# EasyEDA Pro project Project_FT-LINK_2024-04-09.epro

# Schematic FT-LINK-v1
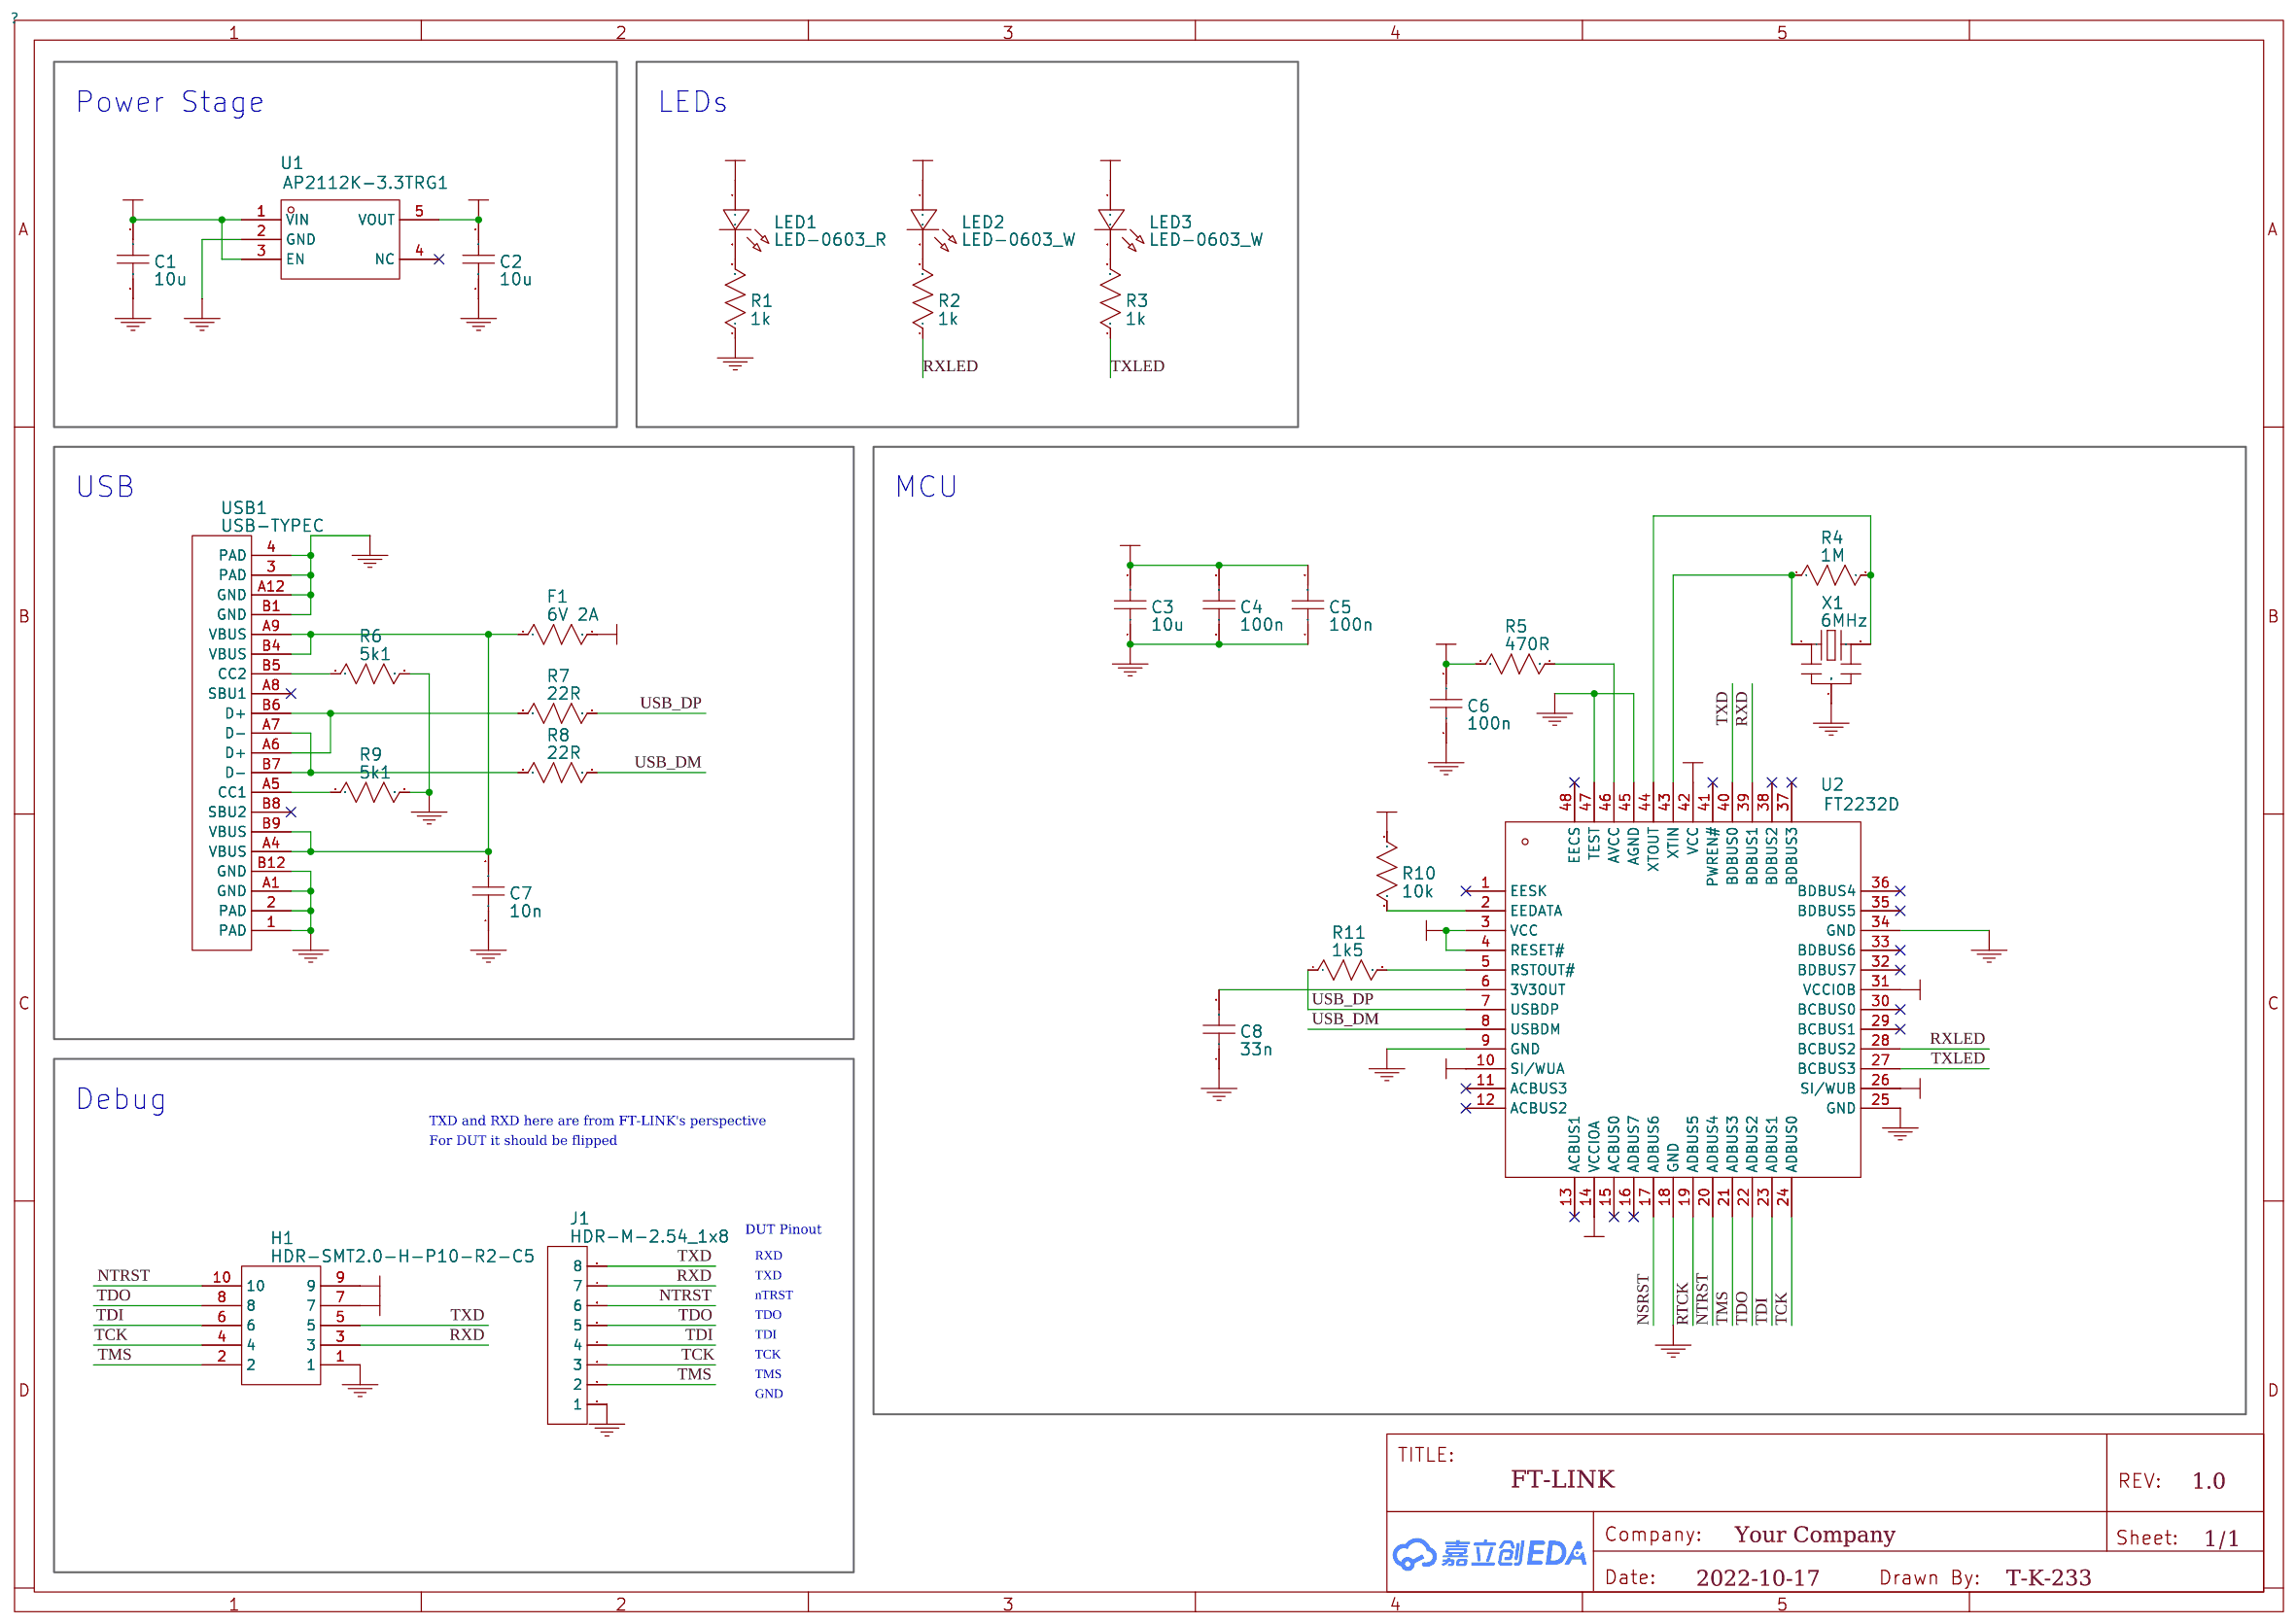
[diagram p0: schematic sheet]

## Parts
C1  10u  [CAPA-0603]
C2  10u  [CAPA-0603]
C3  10u  [CAPA-0603]
C4  100n  [CAPA-0402]
C5  100n  [CAPA-0402]
C6  100n  [CAPA-0402]
C7  10n  [CAPA-0402]
C8  33n  [CAPA-0603]
F1  6V 2A  [R0805]
H1  HDR-SMT2.0-H-P10-R2-C5  [HDR-SMT2.0-H-P10-R2-C5]  (no BOM)
J1  HDR-M-2.54_1x8  [HDR-M-2.54_1X8]
LED1  LED-0603_R  [LED-0603]
LED2  LED-0603_W  [LED-0603]
LED3  LED-0603_W  [LED-0603]
R1  1k  [RES-0402]
R2  1k  [RES-0402]
R3  1k  [RES-0402]
R4  1M  [RES-0402]
R5  470R  [RES-0402]
R6  5k1  [RES-0402]
R7  22R  [RES-0402]
R8  22R  [RES-0402]
R9  5k1  [RES-0402]
R10  10k  [RES-0402]
R11  1k5  [RES-0402]
U1  AP2112K-3.3TRG1  [SOT-25-5_L3.0-W1.8-P0.95-LS3.0-BR]
U2  FT2232D  [LQFP-48_L7.0-W7.0-P0.50-LS9.0-BL]
USB1  USB-TYPEC  [USB-C-SMD_KH-TYPE-C-16P]
X1  6MHz  [CRYSTAL-SMD_3P-L4.5-W2.0-L]

## Library data of the parts
C1-C3 = CL10A106KP8NNNC: Supplier Part: C19702; Supplier: LCSC; Manufacturer: SAMSUNG; link: https://atta.szlcsc.com/upload/public/pdf/source/20160103/1457707703378.pdf
C4-C6 = CL05B104KB54PNC: Supplier Part: C307331; Supplier: LCSC; Manufacturer: SAMSUNG; link: https://atta.szlcsc.com//upload/public/pdf/source/20160103/1457707735223.pdf
C7 = CL05B103KB5NNNC: Supplier Part: C15195; Supplier: LCSC; Manufacturer: SAMSUNG; link: https://atta.szlcsc.com//upload/public/pdf/source/20160103/1457707735223.pdf
C8 = CL10B333KB8NNNC: Supplier Part: C21117; Supplier: LCSC; Manufacturer: SAMSUNG; link: https://atta.szlcsc.com//upload/public/pdf/source/20160103/1457707679526.pdf
F1 = SL0805200: Supplier Part: C70158; Supplier: LCSC; Manufacturer: TECHFUSE
H1 = HDR-SMT2.0-H-P10-R2-C5
J1 = HDR-M-2.54_1x8: Supplier Part: C190820; Supplier: LCSC
LED1 = 19-217/R6C-AL1M2VY/3T: Manufacturer: EVERLIGHT 台湾亿光; Supplier Part: C72044; Supplier: LCSC; link: https://atta.szlcsc.com//upload/public/pdf/source/20160507/1462613613821.pdf
LED2 LED3 = LED White: Manufacturer: KENTO; Supplier Part: C2290; Supplier: LCSC; link: https://atta.szlcsc.com//upload/public/pdf/source/20160507/1462613613821.pdf
R1-R3 = 0402WGF1001TCE: Supplier Part: C11702; Supplier: LCSC; Manufacturer: UniOhm 台湾厚声; link: https://atta.szlcsc.com//upload/public/pdf/source/20200306/C422600_1E6D84923E4A46A82E41ADD87F860B5C.pdf
R4 = 0402WGF1004TCE: Supplier Part: C26083; Supplier: LCSC; Manufacturer: UniOhm 台湾厚声; link: https://atta.szlcsc.com//upload/public/pdf/source/20200306/C422600_1E6D84923E4A46A82E41ADD87F860B5C.pdf
R5 = 0402WGF4700TCE: Supplier Part: C25117; Supplier: LCSC; Manufacturer: UniOhm 台湾厚声; link: https://atta.szlcsc.com//upload/public/pdf/source/20200306/C422600_1E6D84923E4A46A82E41ADD87F860B5C.pdf
R6 R9 = 0402WGF5101TCE: Supplier Part: C25905; Supplier: LCSC; Manufacturer: UniOhm 台湾厚声; link: https://atta.szlcsc.com//upload/public/pdf/source/20200306/C422600_1E6D84923E4A46A82E41ADD87F860B5C.pdf
R7 R8 = 0402WGF220JTCE: Supplier Part: C25092; Supplier: LCSC; Manufacturer: UniOhm 台湾厚声; link: https://atta.szlcsc.com//upload/public/pdf/source/20200306/C422600_1E6D84923E4A46A82E41ADD87F860B5C.pdf
R10 = 0402WGF1002TCE: Supplier Part: C25744; Supplier: LCSC; Manufacturer: UniOhm 台湾厚声; link: https://atta.szlcsc.com//upload/public/pdf/source/20200306/C422600_1E6D84923E4A46A82E41ADD87F860B5C.pdf
R11 = 0402WGF1501TCE: Supplier Part: C25867; Supplier: LCSC; Manufacturer: UniOhm 台湾厚声
U1 = AP2112K-3.3TRG1: Supplier: LCSC; Manufacturer: DIODES; Supplier Part: C51118; JLCPCB Part Class: Extended Part; link: https://www.diodes.com/assets/Datasheets/AP2112.pdf
U2 = FT2232D: Supplier: LCSC; Supplier Part: C428116; Manufacturer: FTDI; JLCPCB Part Class: Extended Part; link: http://www.ftdichip.com/Support/Documents/DataSheets/ICs/DS_FT2232D.pdf
USB1 = KH-TYPE-C-16P: Manufacturer: Shenzhen Kinghelm Elec; Supplier: LCSC; Supplier Part: C709357; link: https://atta.szlcsc.com/upload/public/pdf/source/20211022/DACD6552F639E9483017DE6DC0E61150.pdf
X1 = CSTCR6M00G53-R0: Supplier: LCSC; Manufacturer: muRata(村田); Supplier Part: C85845; JLCPCB Part Class: Extended Part

## Nets
3V3: C2.2 C3.2 C4.2 C5.2 H1.7 LED1.1 LED2.1 LED3.1 U1.5(VOUT) U2.10(SI/WUA) U2.14(VCCIOA) U2.26(SI/WUB) U2.31(VCCIOB)
5V: C1.2 C6.2 F1.2 H1.9 R5.1 R10.1 U1.1(VIN) U1.3(EN) U2.3(VCC) U2.4(RESET#) U2.42(VCC)
GND: C1.1 C2.1 C3.1 C4.1 C5.1 C6.1 C7.1 C8.1 H1.1 J1.1 R1.1 R6.2 R9.2 U1.2(GND) U2.9(GND) U2.18(GND) U2.25(GND) U2.34(GND) U2.45(AGND) U2.47(TEST) USB1.1(PAD) USB1.2(PAD) USB1.3(PAD) USB1.4(PAD) USB1.A1(GND) USB1.A12(GND) USB1.B1(GND) USB1.B12(GND) X1.2(GND)
NSRST: U2.17(ADBUS6)
NTRST: H1.10 J1.6 U2.20(ADBUS4)
RTCK: U2.19(ADBUS5)
RXD: H1.3 J1.7 U2.39(BDBUS1)
RXLED: R2.1 U2.28(BCBUS2)
TCK: H1.4 J1.3 U2.24(ADBUS0)
TDI: H1.6 J1.4 U2.23(ADBUS1)
TDO: H1.8 J1.5 U2.22(ADBUS2)
TMS: H1.2 J1.2 U2.21(ADBUS3)
TXD: H1.5 J1.8 U2.40(BDBUS0)
TXLED: R3.1 U2.27(BCBUS3)
USB_DM: R8.2 U2.8(USBDM)
USB_DP: R7.2 R11.1 U2.7(USBDP)
C8_2: C8.2 U2.6(3V3OUT)
F1_1: C7.2 F1.1 USB1.A4(VBUS) USB1.A9(VBUS) USB1.B4(VBUS) USB1.B9(VBUS)
LED1_2: LED1.2 R1.2
LED2_2: LED2.2 R2.2
LED3_2: LED3.2 R3.2
R4_1: R4.1 U2.43(XTIN) X1.1(IN)
R4_2: R4.2 U2.44(XTOUT) X1.3(OUT)
R5_2: R5.2 U2.46(AVCC)
R6_1: R6.1 USB1.B5(CC2)
R9_1: R9.1 USB1.A5(CC1)
R10_2: R10.2 U2.2(EEDATA)
R11_2: R11.2 U2.5(RSTOUT#)
USB1_A6: R7.1 USB1.A6(D+) USB1.B6(D+)
USB1_B7: R8.1 USB1.A7(D-) USB1.B7(D-)

Not connected (* = marked no-connect by the designer): U1 4(NC)*; U2 1(EESK)* 11(ACBUS3)* 12(ACBUS2)* 13(ACBUS1)* 15(ACBUS0)* 16(ADBUS7)* 29(BCBUS1)* 30(BCBUS0)* 32(BDBUS7)* 33(BDBUS6)* 35(BDBUS5)* 36(BDBUS4)* 37(BDBUS3)* 38(BDBUS2)* 41(PWREN#)* 48(EECS)*; USB1 A8(SBU1)* B8(SBU2)*

## Notes on the sheet
- Power Stage
- LEDs
- USB
- MCU
- Debug
- For DUT it should be flipped
- TXD and RXD here are from FT-LINK's perspective
- DUT Pinout
- RXD
- TXD
- nTRST
- TDO
- TDI
- TCK
- TMS
- GND

# Schematic FT-LINK-v2
Create Date: 2024-02-24; Project Name: FT-LINK; Schematic Name: FT-LINK-v2; Update Date: 2024-02-29; Company: UC Berkeley; Version: V2.0.0
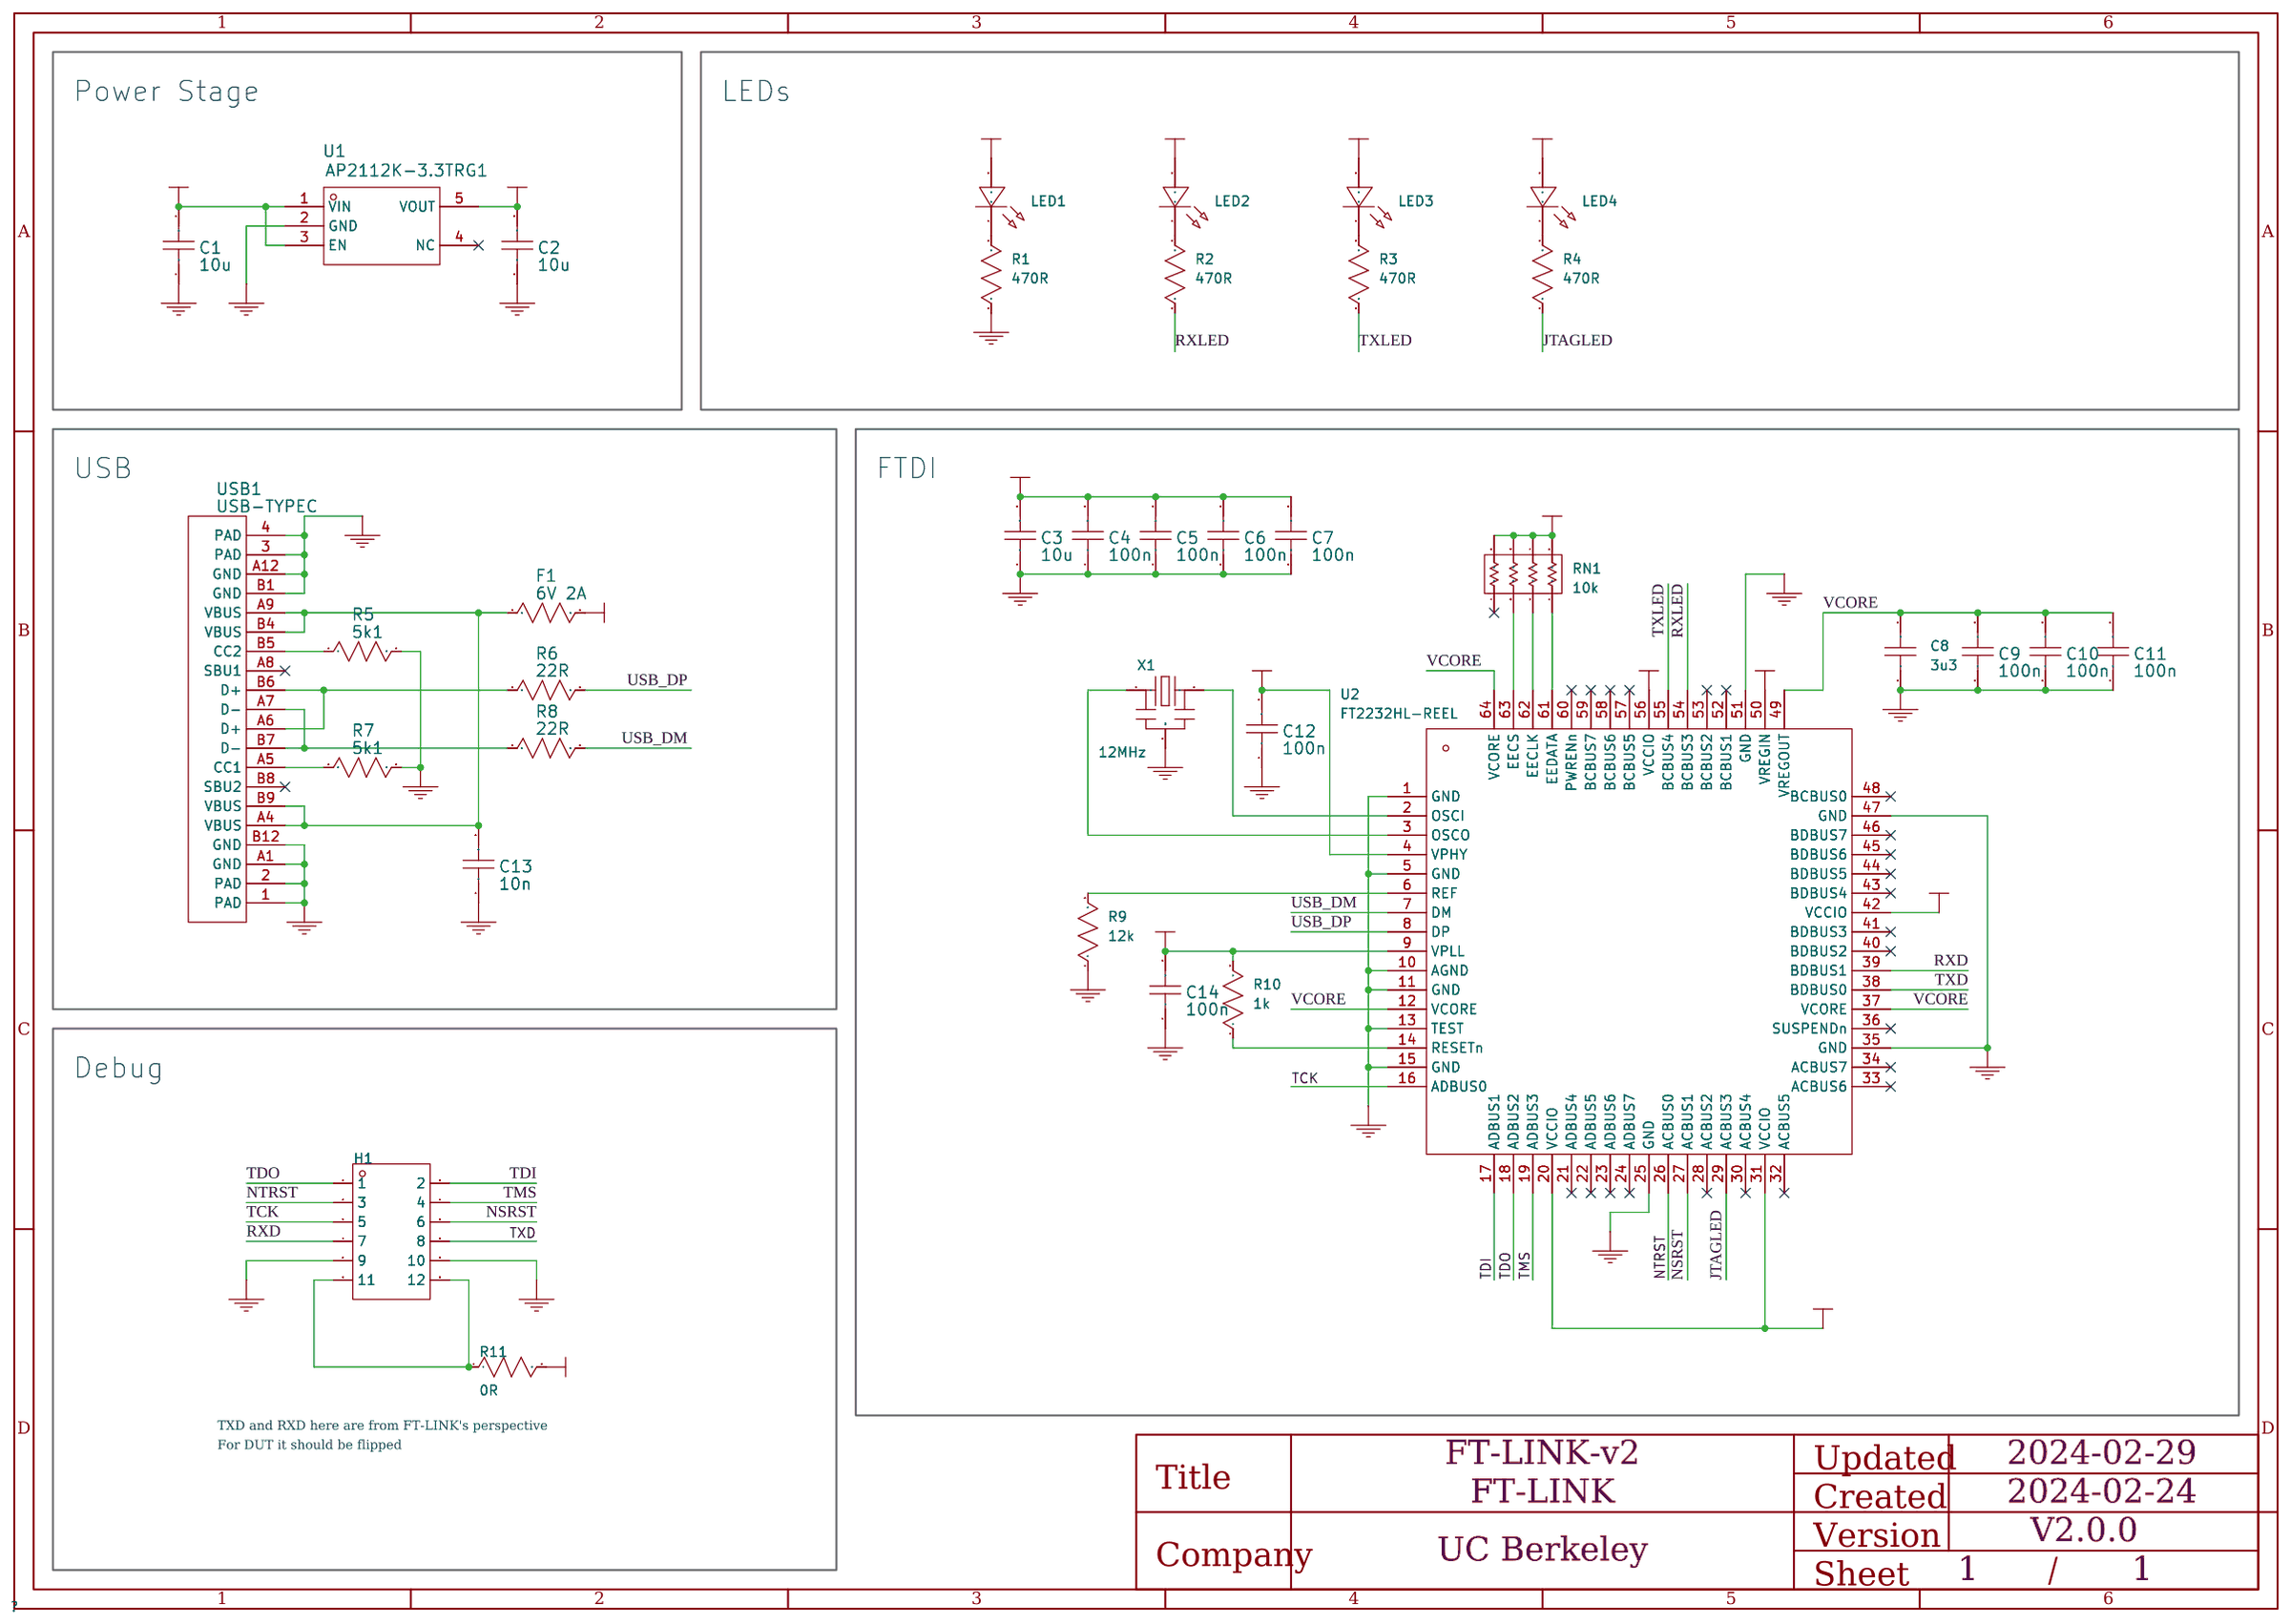
[diagram p1: schematic sheet]

## Parts
C1  10u  [CAPA-0603]
C2  10u  [CAPA-0603]
C3  10u  [CAPA-0603]
C4  100n  [CAPA-0402]
C5  100n  [CAPA-0402]
C6  100n  [CAPA-0402]
C7  100n  [CAPA-0402]
C8  3u3  [CAPA-0603]
C9  100n  [CAPA-0402]
C10  100n  [CAPA-0402]
C11  100n  [CAPA-0402]
C12  100n  [CAPA-0402]
C13  10n  [CAPA-0402]
C14  100n  [CAPA-0402]
F1  6V 2A  [R0805]
H1  -  [CONN-TH_A2541WR-2X6P]
LED1  -  [LED-0603]
LED2  -  [LED-0603]
LED3  -  [LED-0603]
LED4  -  [LED-0603]
R1  470R  [RES-0402]
R2  470R  [RES-0402]
R3  470R  [RES-0402]
R4  470R  [RES-0402]
R5  5k1  [RES-0402]
R6  22R  [RES-0402]
R7  5k1  [RES-0402]
R8  22R  [RES-0402]
R9  12k  [RES-0402]
R10  1k  [RES-0402]
R11  0R  [RES-0402-TIE]  (no BOM)
RN1  10k  [RES-ARRAY-SMD_0402-8P-L2.0-W1.0-BL]
U1  AP2112K-3.3TRG1  [SOT-25-5_L3.0-W1.8-P0.95-LS3.0-BR]
U2  FT2232HL-REEL  [LQFP-64_L10.0-W10.0-P0.50-LS12.0-TL]
USB1  USB-TYPEC  [USB-C-SMD_KH-TYPE-C-16P]
X1  12MHz  [OSC-SMD_3P-L3.2-W1.3-P1.2-L]

## Library data of the parts
C1-C3 = CL10A106KP8NNNC: Supplier Part: C19702; Supplier: LCSC; Manufacturer: SAMSUNG; link: https://atta.szlcsc.com/upload/public/pdf/source/20160103/1457707703378.pdf
C4-C7 C9-C12 C14 = CL05B104KB54PNC: Supplier Part: C307331; Supplier: LCSC; Manufacturer: SAMSUNG; link: https://atta.szlcsc.com//upload/public/pdf/source/20160103/1457707735223.pdf
C8 = CAPA-0603_3u3_25V: 3.3uF ±10% 25V X5R; Supplier Part: C342962; Supplier: LCSC; Manufacturer Part: C1608X5R1E335KT000E; Manufacturer: TDK; link: https://atta.szlcsc.com/upload/public/pdf/source/20170325/1490427913016.pdf; JLCPCB Part Class: 基础库
C13 = CL05B103KB5NNNC: Supplier Part: C15195; Supplier: LCSC; Manufacturer: SAMSUNG; link: https://atta.szlcsc.com//upload/public/pdf/source/20160103/1457707735223.pdf
F1 = SL0805200: Supplier Part: C70158; Supplier: LCSC; Manufacturer: TECHFUSE
H1 = A2541WR-2X6P: Supplier: LCSC; Supplier Part: C239337; Manufacturer: CJT 长江连接器; Manufacturer Part: A2541WR-2x6P; link: https://item.szlcsc.com/238441.html?ref=editor&amp;logined=true; JLCPCB Part Class: Extended Part
LED1 = LED-0603_R: 红灯 632nm; Manufacturer: EVERLIGHT 台湾亿光; Manufacturer Part: 19-217/R6C-AL1M2VY/3T; Supplier Part: C72044; Supplier: LCSC; link: https://atta.szlcsc.com//upload/public/pdf/source/20160507/1462613613821.pdf
LED2 LED3 = LED-0603_W: 白灯 高亮; Manufacturer: KENTO; Manufacturer Part: LED White; Supplier Part: C2290; Supplier: LCSC; link: https://atta.szlcsc.com//upload/public/pdf/source/20160507/1462613613821.pdf
LED4 = LED-0603_B: 蓝灯 高亮; Manufacturer: KENTO; Manufacturer Part: XL-0603QBC; Supplier Part: C2288; Supplier: LCSC; link: https://atta.szlcsc.com//upload/public/pdf/source/20150713/1457707325118.pdf
R1-R4 = RES-0402_470R: 厚膜电阻 470Ω ±1% 62.5mW; Supplier Part: C25117; Supplier: LCSC; Manufacturer Part: 0402WGF4700TCE; Manufacturer: UniOhm 台湾厚声; link: https://atta.szlcsc.com//upload/public/pdf/source/20200306/C422600_1E6D84923E4A46A82E41ADD87F860B5C.pdf; JLCPCB Part Class: 基础库
R5 R7 = 0402WGF5101TCE: Supplier Part: C25905; Supplier: LCSC; Manufacturer: UniOhm 台湾厚声; link: https://atta.szlcsc.com//upload/public/pdf/source/20200306/C422600_1E6D84923E4A46A82E41ADD87F860B5C.pdf
R6 R8 = 0402WGF220JTCE: Supplier Part: C25092; Supplier: LCSC; Manufacturer: UniOhm 台湾厚声; link: https://atta.szlcsc.com//upload/public/pdf/source/20200306/C422600_1E6D84923E4A46A82E41ADD87F860B5C.pdf
R9 = RES-0402_12k: 厚膜电阻 12kΩ ±1% 62.5mW; Supplier Part: C25752; Supplier: LCSC; Manufacturer Part: 0402WGF1202TCE; Manufacturer: UniOhm 台湾厚声; link: https://atta.szlcsc.com//upload/public/pdf/source/20200306/C422600_1E6D84923E4A46A82E41ADD87F860B5C.pdf; JLCPCB Part Class: 基础库
R10 = RES-0402_1k: 厚膜电阻 1kΩ ±1% 62.5mW; Supplier Part: C11702; Supplier: LCSC; Manufacturer Part: 0402WGF1001TCE; Manufacturer: UniOhm 台湾厚声; link: https://atta.szlcsc.com//upload/public/pdf/source/20200306/C422600_1E6D84923E4A46A82E41ADD87F860B5C.pdf; JLCPCB Part Class: 基础库
R11 = RES-0402_TIE: JLCPCB Part Class: 基础库
RN1 = RES-0402x4_10k: 10kΩ ±1% 0402x4; LCSC Part Name: 10kΩ ±1% 0402x4; Supplier Part: C136853; Manufacturer: YAGEO 国巨; Manufacturer Part: YC124-FR-0710KL; Supplier Footprint: 0402x4; JLCPCB Part Class: 扩展库; Datasheet: https://atta.szlcsc.com/upload/public/pdf/source/20180730/C256814_200CCA6CC84D78D7E49AE6680727F338.pdf; Supplier: LCSC; Number of Resistors: 4; Tolerance: ±1%; Power(Watts): 62.5mW; Temperature Coefficient: ±200ppm/℃; Number of Pins: 8; NO_CONNECT: yes
U1 = AP2112K-3.3TRG1: Supplier: LCSC; Manufacturer: DIODES; Supplier Part: C51118; JLCPCB Part Class: Extended Part; link: https://www.diodes.com/assets/Datasheets/AP2112.pdf
U2 = FT2232HL: 应用功能:USB转UART；USB转FIFO;接口协议:UART;; LCSC Part Name: USB到串行/FIFO; Supplier Part: C27882; Manufacturer: FTDI; Supplier Footprint: LQFP-64(10x10); JLCPCB Part Class: 扩展库; Datasheet: https://atta.szlcsc.com/upload/public/pdf/source/20140319/1457707024994.pdf; Supplier: LCSC; Applications Function: USB转UART；USB转FIFO; Protocol: UART; Supply Voltage: 3V~3.6V; Operating Temperature: -40℃~+85℃
USB1 = KH-TYPE-C-16P: Manufacturer: Shenzhen Kinghelm Elec; Supplier: LCSC; Supplier Part: C709357; link: https://atta.szlcsc.com/upload/public/pdf/source/20211022/DACD6552F639E9483017DE6DC0E61150.pdf
X1 = CSTNE12M0GH5C000R0: 频率:12MHz;内置负载电容:33pF;谐振阻抗:30Ω;; LCSC Part Name: 12MHz ±0.07% 内置负载电容:33pF; Supplier Part: C2659460; Manufacturer: muRata 村田; Supplier Footprint: SMD3213-3P; JLCPCB Part Class: 扩展库; Datasheet: https://atta.szlcsc.com/upload/public/pdf/source/20211007/C2659460_6C3FEB8F7D5B458F9C6CAE4C602F43D9.pdf; Supplier: LCSC; Built-in Load Capacitance: 33pF; Resonant Impedance: 30Ω; Operating Temperature: -40℃~+125℃

## Nets
3V3: C2.2 C3.2 C4.2 C5.2 C6.2 C7.2 C12.2 C14.2 LED1.2 LED2.2 LED3.2 LED4.2 R10.2 R11.2 RN1.5 RN1.6 RN1.7 RN1.8 U1.5(VOUT) U2.4(VPHY) U2.9(VPLL) U2.20(VCCIO) U2.31(VCCIO) U2.42(VCCIO) U2.50(VREGIN) U2.56(VCCIO)
5V: C1.2 F1.2 U1.1(VIN) U1.3(EN)
GND: C1.1 C2.1 C3.1 C4.1 C5.1 C6.1 C7.1 C8.2 C9.1 C10.1 C11.1 C12.1 C13.1 C14.1 H1.9 H1.10 R1.1 R5.2 R7.2 R9.1 U1.2(GND) U2.1(GND) U2.5(GND) U2.10(AGND) U2.11(GND) U2.13(TEST) U2.15(GND) U2.25(GND) U2.35(GND) U2.47(GND) U2.51(GND) USB1.1(PAD) USB1.2(PAD) USB1.3(PAD) USB1.4(PAD) USB1.A1(GND) USB1.A12(GND) USB1.B1(GND) USB1.B12(GND) X1.2(GND)
JTAGLED: R4.1 U2.29(ACBUS3)
NSRST: H1.6 U2.27(ACBUS1)
NTRST: H1.3 U2.26(ACBUS0)
RXD: H1.7 U2.39(BDBUS1)
RXLED: R2.1 U2.54(BCBUS3)
TCK: H1.5 U2.16(ADBUS0)
TDI: H1.2 U2.17(ADBUS1)
TDO: H1.1 U2.18(ADBUS2)
TMS: H1.4 U2.19(ADBUS3)
TXD: H1.8 U2.38(BDBUS0)
TXLED: R3.1 U2.55(BCBUS4)
USB_DM: R8.2 U2.7(DM)
USB_DP: R6.2 U2.8(DP)
VCORE: C8.1 C9.2 C10.2 C11.2 U2.12(VCORE) U2.37(VCORE) U2.49(VREGOUT) U2.64(VCORE)
$C13_2: C13.2 F1.1 USB1.A4(VBUS) USB1.A9(VBUS) USB1.B4(VBUS) USB1.B9(VBUS)
$H1_11: H1.11 H1.12 R11.1
$LED1_1: LED1.1 R1.2
$LED2_1: LED2.1 R2.2
$LED3_1: LED3.1 R3.2
$LED4_1: LED4.1 R4.2
$R5_1: R5.1 USB1.B5(CC2)
$R6_1: R6.1 USB1.A6(D+) USB1.B6(D+)
$R7_1: R7.1 USB1.A5(CC1)
$R8_1: R8.1 USB1.A7(D-) USB1.B7(D-)
$R9_2: R9.2 U2.6(REF)
$R10_1: R10.1 U2.14(RESETn)
$RN1_1: RN1.1 U2.61(EEDATA)
$RN1_2: RN1.2 U2.62(EECLK)
$RN1_3: RN1.3 U2.63(EECS)
$U2_2: U2.2(OSCI) X1.3(OUT)
$U2_3: U2.3(OSCO) X1.1(IN)

Not connected (* = marked no-connect by the designer): RN1 4*; U1 4(NC)*; U2 21(ADBUS4)* 22(ADBUS5)* 23(ADBUS6)* 24(ADBUS7)* 28(ACBUS2)* 30(ACBUS4)* 32(ACBUS5)* 33(ACBUS6)* 34(ACBUS7)* 36(SUSPENDn)* 40(BDBUS2)* 41(BDBUS3)* 43(BDBUS4)* 44(BDBUS5)* 45(BDBUS6)* 46(BDBUS7)* 48(BCBUS0)* 52(BCBUS1)* 53(BCBUS2)* 57(BCBUS5)* 58(BCBUS6)* 59(BCBUS7)* 60(PWRENn)*; USB1 A8(SBU1)* B8(SBU2)*

## Notes on the sheet
- Power Stage
- LEDs
- USB
- FTDI
- Debug
- TXD and RXD here are from FT-LINK's perspective
- For DUT it should be flipped

# Board PCB_FT-LINK-v1
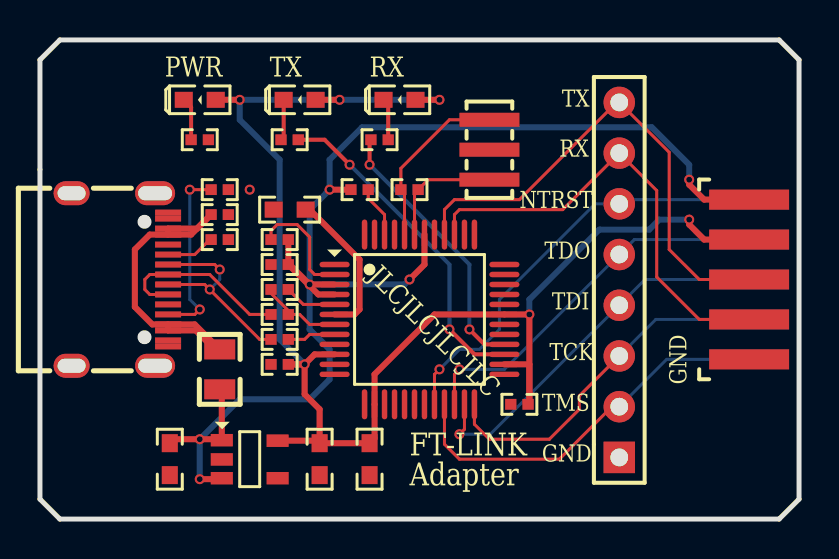
[diagram p2: board, top side]
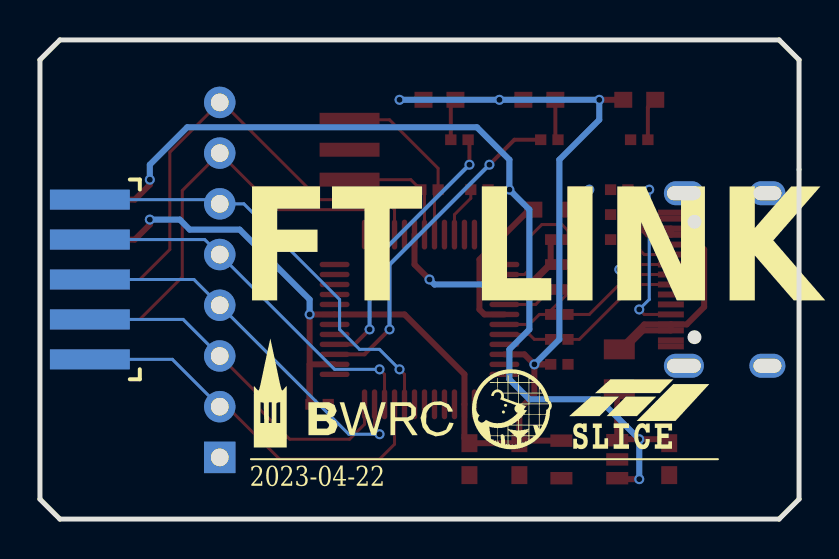
[diagram p3: board, bottom side, seen from below]

Outline 38 x 24 mm; copper layers: Top Layer, Bottom Layer. Coordinates in mm from the lower left corner of the outline.
Outline path: 0,23 0,1 1,0 37,0 38,1 38,23 37,24 1,24 0,23
Stack: Top Layer 0.035mm / Dielectric1 1.51mm FR4 er 4.5 / Bottom Layer 0.035mm

## Design rules (mm)
spacing Default (default): track to track 0.15, other pairs 0 to 0.15
track width Default (default): min 0.15, default 0.15, max 25.4
differential pair differentialPair (default): width min 0.127, default 0.254, max 2.54; gap min 0.152, default 0.152
via Default (default): diameter min 0.5, default 0.5, max 100.025; hole min 0.3, default 0.3, max 59.995
net GND uses gge8404(1)
pour e57 uses gge8404
pour e241 uses gge8404(1)

## Placement (name value [footprint] x y rotation side)
C1  10u  [CAPA-0603]  6.5 3 90 top
C2  10u  [CAPA-0603]  14 3 90 top
C3  10u  [CAPA-0603]  16.5 3 90 top
C4  100n  [CAPA-0402]  24 5.75 0 top
C5  100n  [CAPA-0402]  12 7.75 0 top
C6  100n  [CAPA-0402]  12 12.75 0 top
C7  10n  [CAPA-0402]  9 15.25 180 top
C8  33n  [CAPA-0603]  12.5 15.5 0 top
F1  6V 2A  [R0805]  9 7.5 270 top
H1  -  [HDR-SMT2.0-H-P10-R2-C5]  35.5 12 90 top
J1  HDR-M-2.54_1x8  [HDR-M-2.54_1X8]  29 13.25 90 top
LED1  LED-0603_R  [LED-0603]  8 21 180 top
LED2  LED-0603_W  [LED-0603]  18 21 180 top
LED3  LED-0603_W  [LED-0603]  13 21 180 top
R1  1k  [RES-0402]  8 19 180 top
R2  1k  [RES-0402]  17 19 0 top
R3  1k  [RES-0402]  12.5 19 180 top
R4  1M  [RES-0402]  18.5 16.5 180 top
R5  470R  [RES-0402]  16 16.5 0 top
R6  5k1  [RES-0402]  9 16.5 0 top
R7  22R  [RES-0402]  12 10.25 0 top
R8  22R  [RES-0402]  12 9 0 top
R9  5k1  [RES-0402]  9 14 0 top
R10  10k  [RES-0402]  12 14 180 top
R11  1k5  [RES-0402]  12 11.5 0 top
U1  AP2112K-3.3TRG1  [SOT-25-5_L3.0-W1.8-P0.95-LS3.0-BR]  10.5 3 180 top
U2  FT2232D  [LQFP-48_L7.0-W7.0-P0.50-LS9.0-BL]  19 10 270 top
USB1  USB-TYPEC  [USB-C-SMD_KH-TYPE-C-16P]  4 12 270 top
X1  6MHz  [CRYSTAL-SMD_3P-L4.5-W2.0-L]  22.5 18.5 90 top

## Footprints (pads in the part's own frame, mm; a bottom-side part is the same pattern mirrored in y, then rotated)
CAPA-0402
  rect 0.566x0.54 smd: 1(-0.433,0) 2(0.433,0)
CAPA-0603
  rect 0.9x0.8 smd: 1(-0.798,-0.001) 2(0.801,-0.001)
CRYSTAL-SMD_3P-L4.5-W2.0-L
  rect 0.7x3 smd: 1(-1.5,0) 2(0,0) 3(1.5,0)
HDR-M-2.54_1X8
  rect 1.575x1.575 hole 0.889: 1(-10.16,0)
  round 1.575 hole 0.889: 2(-7.62,0) 3(-5.08,0) 4(-2.54,0) 5(0,0) 6(2.54,0) 7(5.08,0) 8(7.62,0)
HDR-SMT2.0-H-P10-R2-C5
  rect 1x4 smd: 1(-4,0) 3(-2,0) 5(0,0) 7(2,0) 9(4,0)
  rect 1x4 smd far side: 2(-4,0) 4(-2,0) 6(0,0) 8(2,0) 10(4,0)
LED-0603
  rect 0.9x0.8 smd: 1(-0.8,0) 2(0.8,0)
LQFP-48_L7.0-W7.0-P0.50-LS9.0-BL
  oval 0.27x1.5 smd: 1(-2.75,-4.25) 2(-2.25,-4.25) 3(-1.75,-4.25) 4(-1.25,-4.25) 5(-0.75,-4.25) 6(-0.25,-4.25) 7(0.25,-4.25) 8(0.75,-4.25) 9(1.25,-4.25) 10(1.75,-4.25) 11(2.25,-4.25) 12(2.75,-4.25) 25(2.75,4.25) 26(2.25,4.25) 27(1.75,4.25) 28(1.25,4.25) 29(0.75,4.25) 30(0.25,4.25) 31(-0.25,4.25) 32(-0.75,4.25) 33(-1.25,4.25) 34(-1.75,4.25) 35(-2.25,4.25) 36(-2.75,4.25)
  oval 1.5x0.27 smd: 13(4.25,-2.75) 14(4.25,-2.25) 15(4.25,-1.75) 16(4.25,-1.25) 17(4.25,-0.75) 18(4.25,-0.25) 19(4.25,0.25) 20(4.25,0.75) 21(4.25,1.25) 22(4.25,1.75) 23(4.25,2.25) 24(4.25,2.75) 37(-4.25,2.75) 38(-4.25,2.25) 39(-4.25,1.75) 40(-4.25,1.25) 41(-4.25,0.75) 42(-4.25,0.25) 43(-4.25,-0.25) 44(-4.25,-0.75) 45(-4.25,-1.25) 46(-4.25,-1.75) 47(-4.25,-2.25) 48(-4.25,-2.75)
R0805
  rect 1x1.55 smd: 1(-1,0) 2(1,0)
RES-0402
  rect 0.566x0.54 smd: 1(-0.433,0) 2(0.433,0)
SOT-25-5_L3.0-W1.8-P0.95-LS3.0-BR
  rect 1.105x0.623 smd: 1(1.397,-0.953) 2(1.397,0.013) 3(1.397,0.953) 4(-1.397,0.953) 5(-1.397,-0.927)
USB-C-SMD_KH-TYPE-C-16P
  oval 1.2x2 hole 0.7x1.7: 1(-4.32,1.765) 2(4.32,1.765)
  oval 1.2x1.8 hole 0.7x1.4: 3(-4.32,-2.415) 4(4.32,-2.415)
  rect 0.3x1.3 smd: A1(-3.35,2.415) A4(-2.55,2.415) A5(-1.25,2.415) A6(-0.25,2.415) A7(0.25,2.415) A8(1.25,2.415) A9(2.55,2.415) A12(3.35,2.415) B1(3.05,2.415) B4(2.25,2.415) B5(1.75,2.415) B6(0.75,2.415) B7(-0.75,2.415) B8(-1.75,2.415) B9(-2.25,2.415) B12(-3.05,2.415)

## Nets
As in the schematic.

Pads without a net: U1 4; U2 1 11 12 13 15 16 29 30 32 33 35 36 37 38 41 48; USB1 A8 B8

## Via types
v1: diameter 0.5, hole 0.3, Top Layer to Bottom Layer, 24 vias

## Routing (per net, layer and track width the routed paths; a pad name or vN(x,y) marks a point on that pad's centre or on a via; arc(x,y) is an arc through that point)
3V3: length 74.8
  Top Layer w0.3: U2.14 16.75,4.05 C3.2 C2.2 ; v1(15,21) LED3.1 ; U1.5 13.87,3.93 C2.2 ; v1(13.25,7.75) 13.75,8.25 U2.10 ; v1(13.25,7.75) C5.2 v1(13.25,7.75) ; v1(13.25,7.75) 13.25,6.25 14,5.5 C2.2 ; v1(20,21) LED2.1 ; v1(32.5,15) 32.5,14.75 33.25,14 H1.7 ; 24.5,5.75 24.5,7.75 U2.26 ; 24.5,5.75 v1(24.5,10.25) U2.31 19.75,10.25 16.75,7.25 16.75,5.75 ; 24.5,5.75 24.43,5.75 24.5,5.75 ; LED1.1 v1(10,21)
  Bottom Layer w0.3: v1(24.5,10.25) 24.5,11 28,14.5 30.5,14.5 31,15 v1(32.5,15) ; v1(13.25,7.75) 12,9 12,18 10,20 v1(10,21) v1(20,21)
5V: length 67.4
  Top Layer w0.3: U2.3 v1(13.5,11.75) 12.5,12.75 C6.2 ; C6.2 13.93,11.25 U2.4 ; C6.2 R10.1 ; U2.42 19.25,12.75 v1(18.5,12) ; C1.2 6.7,4 v1(8,4) 9.05,4 U1.1 9.1,6.4 F1.2 ; U1.3 9.05,2 v1(8,2) ; H1.9 33.25,16 32.5,16.75 32.5,17 ; R5.1 v1(14.5,16.5)
  Bottom Layer w0.3: v1(18.5,12) 18.25,11.75 v1(13.5,11.75) ; v1(13.5,11.75) 13.5,15.5 v1(14.5,16.5) 14.5,18 16.12,19.62 30.62,19.62 32.5,17.75 v1(32.5,17) ; v1(13.5,11.75) 13.5,9.5 14.5,8.5 14.5,7 13.5,6 10,6 v1(8,4) v1(8,2)
GND:
  vias: v1(10.5,16.5)
C8_2: length 7.6
  Top Layer w0.3: U2.6 15.75,10.25 16,10.5 16,13 13.5,15.5 C8.2
F1_1: length 18.6
  Top Layer w0.3: USB1.A9 USB1.B4 7.75,9.75 F1.1 8.75,8.5 7.8,9.45 6.41,9.45 ; 6.41,9.75 5.62,9.75 4.75,10.62 4.75,13.5 5.5,14.25 6.41,14.25 ; 8.57,15.25 7.87,14.55 USB1.A4 USB1.B9 7.57,14.25 8.57,15.25
LED1_2: length 2.2
  Top Layer w0.2: LED1.2 7.57,20.63 R1.2
LED2_2: length 2.1
  Top Layer w0.2: R2.2 17.43,20.77 LED2.2
LED3_2: length 2.1
  Top Layer w0.2: LED3.2 12.2,19.13 R3.2
NTRST: length 21.8
  Top Layer w0.15: v1(20,7.5) 19.75,7.25 U2.20
  Bottom Layer w0.15: v1(20,7.5) 21,8.5 22,8.5 23,9.5 23,11 27.79,15.79 J1.6 29.21,16 H1.10
R4_1: length 6.1
  Top Layer w0.15: 18.75,14.25 18.75,16.32 18.93,16.5 ; R4.1 19.43,17 X1.1
R4_2: length 8.8
  Top Layer w0.15: X1.3 20.5,20 18.07,17.57 R4.2 18.25,16.32 U2.44
R5_2: length 2.6
  Top Layer w0.15: U2.46 17.25,15.25 16.43,16.07 R5.2
R6_1: length 9
  Top Layer w0.15: USB1.B5 7.75,10.25 v1(8,10.5) ; R6.1 v1(7.5,16.5)
  Bottom Layer w0.15: v1(7.5,16.5) 7.5,11 v1(8,10.5)
R9_1: length 2.5
  Top Layer w0.15: USB1.A5 7.75,13.25 8.5,14 R9.1
R10_2: length 5.7
  Top Layer w0.15: 14.75,12.25 13.75,12.25 13.5,12.5 13.5,14.12 12.88,14.75 11.87,14.75 11.57,14.44 R10.2
R11_2: length 2.6
  Top Layer w0.15: R11.2 13.18,10.75 U2.5
RXD: length 23
  Top Layer w0.15: U2.39 20.75,15.25 21,15.5 26.17,15.5 J1.7 30.87,16.45 30.87,12.12 33,10 H1.3
RXLED: length 13.7
  Top Layer w0.2: v1(16.5,17.75) 16.5,19 R2.1 ; v1(21.5,9.5) 22.25,8.75 U2.28
  Bottom Layer w0.2: v1(16.5,17.75) 21.5,12.75 v1(21.5,9.5)
TCK: length 17.9
  Top Layer w0.15: U2.24 21.75,4.75 22.5,4 25.5,4 27,5.5 27,6.17 J1.3
  Bottom Layer w0.15: H1.4 30.83,10 J1.3
TDI: length 19.3
  Top Layer w0.15: v1(21,4.25) 21.25,4.5 U2.23
  Bottom Layer w0.15: H1.6 30.29,12 J1.4 22.54,4.25 v1(21,4.25)
TDO: length 19
  Top Layer w0.15: v1(21,7.5) 20.75,7.25 U2.22
  Bottom Layer w0.15: H1.8 29.75,14 J1.5 23.25,7.5 v1(21,7.5)
TMS: length 19.6
  Top Layer w0.15: 20.25,5.75 20.25,3.75 21,3 26,3 28.63,5.63 J1.2
  Bottom Layer w0.15: J1.2 31.37,8 H1.2
TXD: length 25.3
  Top Layer w0.15: U2.40 20.25,15.5 20.75,16 24,16 28.87,20.87 J1.8 31.5,18.37 31.5,13.5 33,12 H1.5
TXLED: length 16.7
  Top Layer w0.2: v1(15.5,17.75) 14.25,19 R3.1 ; v1(20.5,9.5) 21.75,8.25 23.25,8.25
  Bottom Layer w0.2: v1(20.5,9.5) 20.5,12.75 v1(15.5,17.75)
USB1_A6: length 9
  Top Layer w0.15: USB1.B6 5.5,11.25 5.25,11.5 5.25,12 5.5,12.25 USB1.A6 ; 6.41,12.25 8.5,12.25 10.5,10.25 R7.1
USB1_B7: length 10.2
  Top Layer w0.15: R8.1 11,9 v1(8.5,11.5) 8.25,11.75 USB1.A7 ; v1(9,12.5) 8.75,12.75 USB1.B7
  Bottom Layer w0.15: v1(9,12.5) 9,12 v1(8.5,11.5)
USB_DM: length 2.4
  Top Layer w0.15: 12.43,9 13.25,9 13.5,9.25 14.75,9.25
USB_DP: length 4.1
  Top Layer w0.15: U2.7 13.5,9.75 13,10.25 12.43,10.25 12.43,10.44 11.57,11.31 R11.1

## Copper pours and planes (outline as drawn; the poured copper is in the pictures)
GND on Top Layer: -5,28 -5,-4 49,-4 49,28
GND on Bottom Layer: -9,28 -9,-4 45,-4 45,28

## Text on the board
Bottom Silkscreen Layer: FT LINK | 2023-04-22
Top Silkscreen Layer: NTRST | TMS | GND | TDO | TCK | TDI | RX | TX | PWR | JLCJLCJLCJLC | FT-LINK | Adapter

# Board PCB_FT-LINK-v2
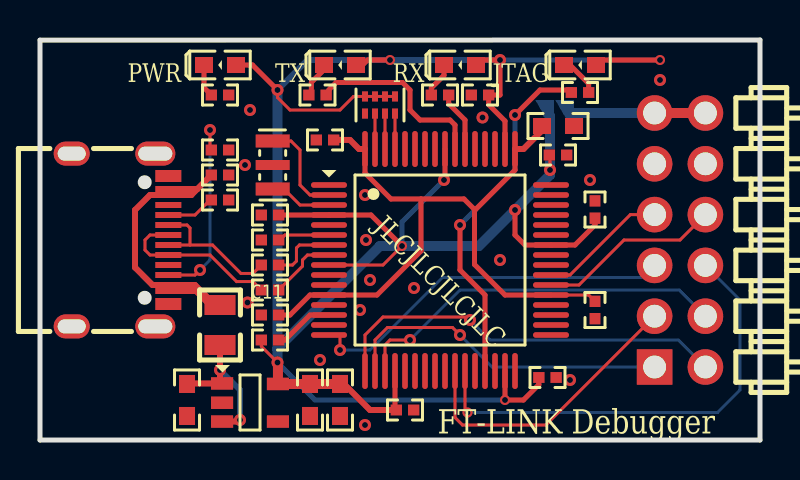
[diagram p4: board, top side]
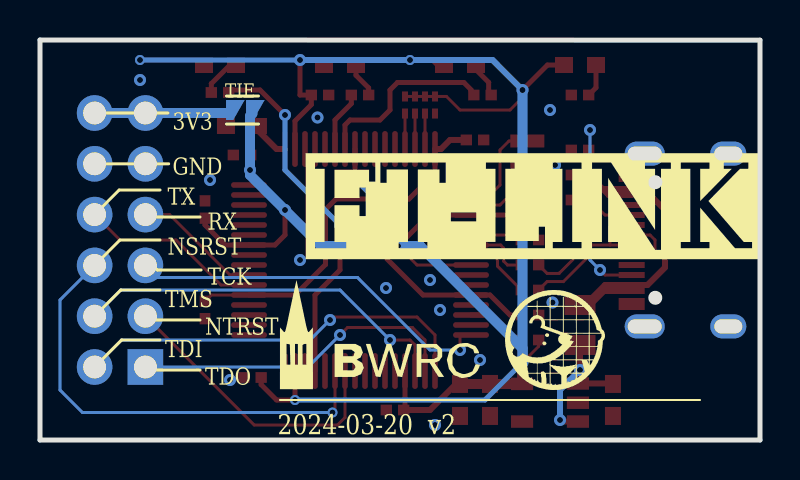
[diagram p5: board, bottom side, seen from below]

Outline 36 x 20 mm; copper layers: Top Layer, Bottom Layer. Coordinates in mm from the lower left corner of the outline.
Outline path: 0,19.99 0,0 36,0 36,20 0,19.99
Stack: Top Layer 0.035mm / Dielectric1 1.51mm FR4 er 4.5 / Bottom Layer 0.035mm

## Design rules (mm)
net USB_DP: USB_1
net USB_DM: USB_1
net $R8_1: USB_2
net $R6_1: USB_2
template: 用户自定义配置
spacing Default (default): track to track 0.15, other pairs 0 to 0.15
track width Default (default): min 0.15, default 0.15, max 25.4
differential pair differentialPair (default): width min 0.127, default 0.254, max 2.54; gap min 0.152, default 0.152
via Default (default): diameter min 0.5, default 0.5, max 100.025; hole min 0.3, default 0.3, max 59.995
pour e241 uses Default

## Placement (name value [footprint] x y rotation side)
C1  10u  [CAPA-0603]  7.35 2 90 top
C2  10u  [CAPA-0603]  13.5 2 90 top
C3  10u  [CAPA-0603]  15 2 90 top
C4  100n  [CAPA-0402]  25.9 14.25 180 top
C5  100n  [CAPA-0402]  11.5 11.25 0 top
C6  100n  [CAPA-0402]  18.25 1.5 180 top
C7  100n  [CAPA-0402]  25.38 3.13 180 top
C8  3u3  [CAPA-0603]  25.9 15.7 0 top
C9  100n  [CAPA-0402]  14.25 15 0 top
C10  100n  [CAPA-0402]  27.75 6.5 90 top
C11  100n  [CAPA-0402]  11.5 6.25 0 top
C12  100n  [CAPA-0402]  27.75 11.52 270 top
C13  10n  [CAPA-0402]  9 13.25 180 top
C14  100n  [CAPA-0402]  22 17.25 0 top
F1  6V 2A  [R0805]  9 5.75 270 top
H1  -  [CONN-TH_A2541WR-2X6P]  32 10 270 top
LED1  -  [LED-0603]  9 18.75 180 top
LED2  -  [LED-0603]  21 18.75 180 top
LED3  -  [LED-0603]  15 18.75 180 top
LED4  -  [LED-0603]  27 18.75 180 top
R1  470R  [RES-0402]  9 17.25 180 top
R2  470R  [RES-0402]  20 17.25 180 top
R3  470R  [RES-0402]  13.88 17.25 180 top
R4  470R  [RES-0402]  27 17.38 0 top
R5  5k1  [RES-0402]  9 14.5 0 top
R6  22R  [RES-0402]  11.5 7.5 0 top
R7  5k1  [RES-0402]  9 12 0 top
R8  22R  [RES-0402]  11.5 8.75 0 top
R9  12k  [RES-0402]  11.5 10 0 top
R10  1k  [RES-0402]  11.5 5 180 top
R11  0R  [RES-0402-TIE]  25.88 16.5 180 bottom
RN1  10k  [RES-ARRAY-SMD_0402-8P-L2.0-W1.0-BL]  17 16.75 180 top
U1  AP2112K-3.3TRG1  [SOT-25-5_L3.0-W1.8-P0.95-LS3.0-BR]  10.5 1.88 180 top
U2  FT2232HL-REEL  [LQFP-64_L10.0-W10.0-P0.50-LS12.0-TL]  20 9 0 top
USB1  USB-TYPEC  [USB-C-SMD_KH-TYPE-C-16P]  4 10 270 top
X1  12MHz  [OSC-SMD_3P-L3.2-W1.3-P1.2-L]  11.63 13.75 90 top

## Footprints (pads in the part's own frame, mm; a bottom-side part is the same pattern mirrored in y, then rotated)
CAPA-0402
  rect 0.566x0.54 smd: 1(-0.433,0) 2(0.433,0)
CAPA-0603
  rect 0.9x0.8 smd: 1(-0.798,-0.001) 2(0.801,-0.001)
CONN-TH_A2541WR-2X6P
  rect 1.778x1.778 hole 1.143: 1(6.35,-1.27)
  round 1.778 hole 1.143: 2(6.35,1.27) 3(3.81,-1.27) 4(3.81,1.27) 5(1.27,-1.27) 6(1.27,1.27) 7(-1.27,-1.27) 8(-1.27,1.27) 9(-3.81,-1.27) 10(-3.81,1.27) 11(-6.35,-1.27) 12(-6.35,1.27)
LED-0603
  rect 0.9x0.8 smd: 1(0.8,0) 2(-0.8,0)
LQFP-64_L10.0-W10.0-P0.50-LS12.0-TL
  oval 1.8x0.28 smd: 1(-5.55,3.75) 2(-5.55,3.25) 3(-5.55,2.75) 4(-5.55,2.25) 5(-5.55,1.75) 6(-5.55,1.25) 7(-5.55,0.75) 8(-5.55,0.25) 9(-5.55,-0.25) 10(-5.55,-0.75) 11(-5.55,-1.25) 12(-5.55,-1.75) 13(-5.55,-2.25) 14(-5.55,-2.75) 15(-5.55,-3.25) 16(-5.55,-3.75) 33(5.55,-3.75) 34(5.55,-3.25) 35(5.55,-2.75) 36(5.55,-2.25) 37(5.55,-1.75) 38(5.55,-1.25) 39(5.55,-0.75) 40(5.55,-0.25) 41(5.55,0.25) 42(5.55,0.75) 43(5.55,1.25) 44(5.55,1.75) 45(5.55,2.25) 46(5.55,2.75) 47(5.55,3.25) 48(5.55,3.75)
  oval 0.28x1.8 smd: 17(-3.75,-5.55) 18(-3.25,-5.55) 19(-2.75,-5.55) 20(-2.25,-5.55) 21(-1.75,-5.55) 22(-1.25,-5.55) 23(-0.75,-5.55) 24(-0.25,-5.55) 25(0.25,-5.55) 26(0.75,-5.55) 27(1.25,-5.55) 28(1.75,-5.55) 29(2.25,-5.55) 30(2.75,-5.55) 31(3.25,-5.55) 32(3.75,-5.55) 49(3.75,5.55) 50(3.25,5.55) 51(2.75,5.55) 52(2.25,5.55) 53(1.75,5.55) 54(1.25,5.55) 55(0.75,5.55) 56(0.25,5.55) 57(-0.25,5.55) 58(-0.75,5.55) 59(-1.25,5.55) 60(-1.75,5.55) 61(-2.25,5.55) 62(-2.75,5.55) 63(-3.25,5.55) 64(-3.75,5.55)
OSC-SMD_3P-L3.2-W1.3-P1.2-L
  rect 0.65x1.7 smd: 1(-1.2,0) 3(1.2,0)
  rect 0.5x1.7 smd: 2(0,0)
R0805
  rect 1x1.55 smd: 1(-1,0) 2(1,0)
RES-0402
  rect 0.566x0.54 smd: 1(-0.433,0) 2(0.433,0)
RES-0402-TIE
  custom 0.931x1 smd: 1(-0.5,0) 2(0.5,0)
  custom 0x0 smd: 4(0.525,0.017) 6(0.676,0.141)
RES-ARRAY-SMD_0402-8P-L2.0-W1.0-BL
  rect 0.3x0.505 smd: 1(-0.75,0.427) 2(-0.25,0.427) 3(0.25,0.427) 4(0.75,0.427) 5(0.75,-0.427) 6(0.25,-0.427) 7(-0.25,-0.427) 8(-0.75,-0.427)
SOT-25-5_L3.0-W1.8-P0.95-LS3.0-BR
  rect 1.105x0.623 smd: 1(1.397,-0.953) 2(1.397,0.013) 3(1.397,0.953) 4(-1.397,0.953) 5(-1.397,-0.927)
USB-C-SMD_KH-TYPE-C-16P
  oval 1.2x2 hole 0.7x1.7: 1(-4.32,1.765) 2(4.32,1.765)
  oval 1.2x1.8 hole 0.7x1.4: 3(-4.32,-2.415) 4(4.32,-2.415)
  rect 0.3x1.3 smd: A1(-3.35,2.415) A4(-2.55,2.415) A5(-1.25,2.415) A6(-0.25,2.415) A7(0.25,2.415) A8(1.25,2.415) A9(2.55,2.415) A12(3.35,2.415) B1(3.05,2.415) B4(2.25,2.415) B5(1.75,2.415) B6(0.75,2.415) B7(-0.75,2.415) B8(-1.75,2.415) B9(-2.25,2.415) B12(-3.05,2.415)

## Nets
As in the schematic.

Pads without a net: R11 4 6; RN1 4; U1 4; U2 21 22 23 24 28 30 32 33 34 36 40 41 43 44 45 46 48 52 53 57 58 59 60; USB1 A8 B8

## Via types
v1: diameter 0.6, hole 0.3, Top Layer to Bottom Layer, 31 vias
v2: diameter 0.5, hole 0.3, Top Layer to Bottom Layer, 5 vias

## Routing (per net, layer and track width the routed paths; a pad name or vN(x,y) marks a point on that pad's centre or on a via; arc(x,y) is an arc through that point)
3V3: length 125.9
  Top Layer w0.15: v1(11.88,3.88) 11.07,4.68 R10.2 ; v2(18.1,9.7) 17.15,8.75 U2.9 ; C4.2 25.5,14.22 v1(25.5,13.5) ; RN1.8 RN1.7 RN1.6 RN1.5 15.68,17.18 15,16.5 12.5,16.5 11.88,17.12 v1(11.88,17.5)
  Top Layer w0.25: U2.56 20.25,13.05 v1(20.2,13) ; C7.2 24.94,2.77 24.17,2 v2(23.25,2) U2.31 ; v1(23.75,11.5) 23.75,10.25 24.25,9.75 U2.42 26.75,9.75 27.75,10.75 C12.2 ; v1(11.88,17.5) 10.62,18.75 10,18.75 ; C5.2 U2.4 16.55,11.25 v2(18.1,9.7) ; v2(31,19) 28.05,19 LED4.2 ; LED2.2 22.05,19 v1(23,19) 23,17.25 C14.2 22.43,16.77 23.25,15.95 U2.50 ; v2(17.5,19) 16.38,19 16.13,18.75 ; U2.20 17.75,1.5
  Top Layer w0.3: 17.75,1.5 16.5,1.5 15.2,2.8 C3.2 ; 17.75,1.5 C6.2
  Top Layer w0.5: 15,2.8 11.9,2.8 11.9,3.85 v1(11.88,3.88)
  Bottom Layer w0.15: 11.9,3.5 11.88,3.53 v1(11.88,3.88)
  Bottom Layer w0.25: v2(23.25,2) 13.75,2 v1(11.88,3.88) ; v2(18.1,9.7) 18.1,10.9 v1(20.2,13) ; v1(23,19) v2(31,19)
  Bottom Layer w0.3: v1(23,19) v2(17.5,19) 13.37,19 v1(11.88,17.5)
  Bottom Layer w0.5: v1(23.75,11.5) 25.5,13.25 25.5,16.19 25.38,16.31 ; 23.75,11.5 21.95,9.7 v2(18.1,9.7) 16.99,9.7 11.88,4.58 v1(11.88,3.88) ; 11.87,17.5 11.87,3.88
5V: length 7
  Top Layer w0.3: 9,4.5 v1(9,3.5) 9,3.1 ; v1(10,1) 10,0.94 9.98,0.92 U1.3 ; C1.2 7.38,2.83 U1.1
  Bottom Layer w0.3: v1(10,1) 10,2.5 v1(9,3.5)
GND:
  vias: v1(10.25,13.75) v1(10.38,6.88) v1(10.5,16.5) v1(14,4) v1(16,6.5) v1(16.25,12.25) v1(16.25,0.75) v1(16.3,10) v1(16.5,8) v1(18.7,7.6) v1(22.12,16.12) v1(23,9) v1(26.5,3) v1(27.5,13) v1(31,18)
$C13_2: length 17.6
  Top Layer w0.3: 7.87,12.55 USB1.A4 USB1.B9 7.57,12.25 7.87,12.55 ; 7.87,12.55 C13.2 ; 6.41,7.75 5.62,7.75 4.75,8.63 4.75,11.5 5.5,12.25 6.41,12.25 ; USB1.A9 USB1.B4 7.75,7.75 9,6.5 8.75,6.5 7.8,7.45 USB1.A9
$H1_11: length 7
  Bottom Layer w0.5: H1.12 H1.11 26.53,16.35 R11.1
$H2_11: length 2.5
  Top Layer w0.5: 30.73,16.35 33.27,16.35
$LED1_1: length 1.7
  Top Layer w0.25: LED1.1 8.2,17.62 R1.2
$LED2_1: length 1.8
  Top Layer w0.25: R2.2 19.57,17.6 20.2,18.24 LED2.1
$LED3_1: length 1.7
  Top Layer w0.25: 14.4,18.89 14.4,18.72 13.57,17.88 13.57,17.5
$LED4_1: length 1.9
  Top Layer w0.25: 27.43,17.5 27.43,17.82 26.5,18.75 LED4.1
$R5_1: length 9.9
  Top Layer w0.15: R5.1 8.5,14.57 v1(8.5,15.5) ; USB1.B5 7.75,8.25 v1(8,8.5)
  Bottom Layer w0.15: v1(8,8.5) 8.5,9 v1(8.5,15.5)
$R6_1: length 8.4
  Top Layer w0.15: R6.1 10.65,7.92 9.83,7.92 8.5,9.25 USB1.B6 5.5,9.25 5.25,9.5 5.25,10 5.5,10.25 USB1.A6
$R7_1: length 2.5
  Top Layer w0.15: USB1.A5 7.75,11.25 8.5,12 R7.1
$R8_1: length 7.4
  Top Layer w0.15: 7.5,9.75 7.5,10.6 7.35,10.75 USB1.B7 ; 7.5,9.75 8.62,9.75 10.05,8.33 10.65,8.33 R8.1 ; 7.5,9.75 USB1.A7
$R9_2: length 2.6
  Top Layer w0.15: 12,10 12.25,10.25 U2.6
$R10_1: length 3
  Top Layer w0.25: R10.1 12.25,5 13.5,6.25 U2.14
$RN1_1: length 1.8
  Top Layer w0.15: U2.61 17.75,16.39
$RN1_2: length 1.8
  Top Layer w0.15: U2.62 17.25,16.39
$RN1_3: length 1.8
  Top Layer w0.15: U2.63 16.75,16.39
$U2_2: length 5
  Top Layer w0.15: U2.2 13.5,12.25 13,12.75 13,14.5 12.55,14.95 X1.3
$U2_3: length 3.1
  Top Layer w0.15: U2.3 13,11.75 12.2,12.55 X1.1
JTAGLED: length 17.8
  Top Layer w0.25: v1(23.75,16.25) 25,17.5 26.57,17.5 ; U2.29 22.25,7.25 21,8.5 v1(21,10.75)
  Bottom Layer w0.25: v1(23.75,16.25) 23.75,13.5 v1(21,10.75)
NSRST: length 23.2
  Top Layer w0.15: v2(21.38,1.38) 21.25,1.5 U2.27
  Bottom Layer w0.15: H1.6 35,7 35,2.5 33.88,1.38 v2(21.38,1.38)
NTRST: length 14.7
  Top Layer w0.15: H1.3 25.29,0.75 21.12,0.75 20.75,1.12 U2.26
RXD: length 6.4
  Top Layer w0.15: H1.7 29.52,11.27 26.5,8.25 U2.39
RXLED: length 3
  Top Layer w0.25: U2.54 21.25,16 20.43,16.82 R2.1
TCK: length 18.8
  Top Layer w0.15: U2.16 15,5.25 v1(15,4.5)
  Bottom Layer w0.15: v1(15,4.5) 16.5,4.5 20.12,8.12 30.12,8.12 H1.5
TDI: length 20.2
  Top Layer w0.15: v1(21.5,6) 21.35,6.15 17.15,6.15 16.25,5.25 U2.17
  Bottom Layer w0.15: v1(21.5,6) 22.5,5 31.92,5 H1.2
TDO: length 16.6
  Top Layer w0.15: v1(21,5.25) 20.62,5.62 17.38,5.62 16.75,5 U2.18
  Bottom Layer w0.15: H1.1 22.6,3.65 v1(21,5.25)
TMS: length 19
  Top Layer w0.15: v1(18.5,5) 17.5,5 17.25,4.75 U2.19
  Bottom Layer w0.15: v1(18.5,5) 21,7.5 31.96,7.5 H1.4
TXD: length 9.2
  Top Layer w0.15: H1.8 32,10 29.2,10 26.95,7.75 U2.38
TXLED: length 9.1
  Top Layer w0.25: 14.43,17.5 14.81,17.88 18.12,17.88 18.5,17.5 18.5,16.5 19,16 20.5,16 20.75,15.75 U2.55
USB_DM: length 3.3
  Top Layer w0.15: U2.7 12.97,9.75 12.82,9.6 12.82,8.95 12.62,8.75 R8.2
USB_DP: length 3.4
  Top Layer w0.15: R6.2 13.12,8.69 13.12,9 13.38,9.25 U2.8
VCORE: length 35.6
  Top Layer w0.15: C10.2 27.43,7.25 U2.37
  Top Layer w0.25: 19.05,12.05 19.05,9.45 16.85,7.25 U2.12 13.5,7.25 12.5,6.25 C11.2 ; 19.05,12.05 21.2,12.05 21.75,11.5 ; 19.05,12.05 17.55,12.05 16.25,13.35 U2.64 ; 21.75,11.5 21.72,11.47 21.72,8.78 23.25,7.25 U2.37 ; 21.75,11.5 23.75,13.5 U2.49
  Top Layer w0.3: U2.49 24.18,14.55 25.1,15.48 C8.1 ; C9.2 15.5,15 15.95,14.55 U2.64

## Copper pours and planes (outline as drawn; the poured copper is in the pictures)
GND on Top Layer: -10.15,26.42 -10.15,-5.58 43.85,-5.58 43.85,26.42
GND on Bottom Layer: -11.1,25.4 -11.1,-6.6 42.9,-6.6 42.9,25.4

## Text on the board
Bottom Silkscreen Layer: TIE | TCK | NTRST | TDO | NSRST | TMS | TDI | RX | 3V3 | GND | TX | 2024-03-20  v2 | FT-LINK
Top Silkscreen Layer: PWR | TX | RX | JTAG | JLCJLCJLCJLC | FT-LINK Debugger
